# EAGLE design NanoModem (EAGLE 6.5.0)
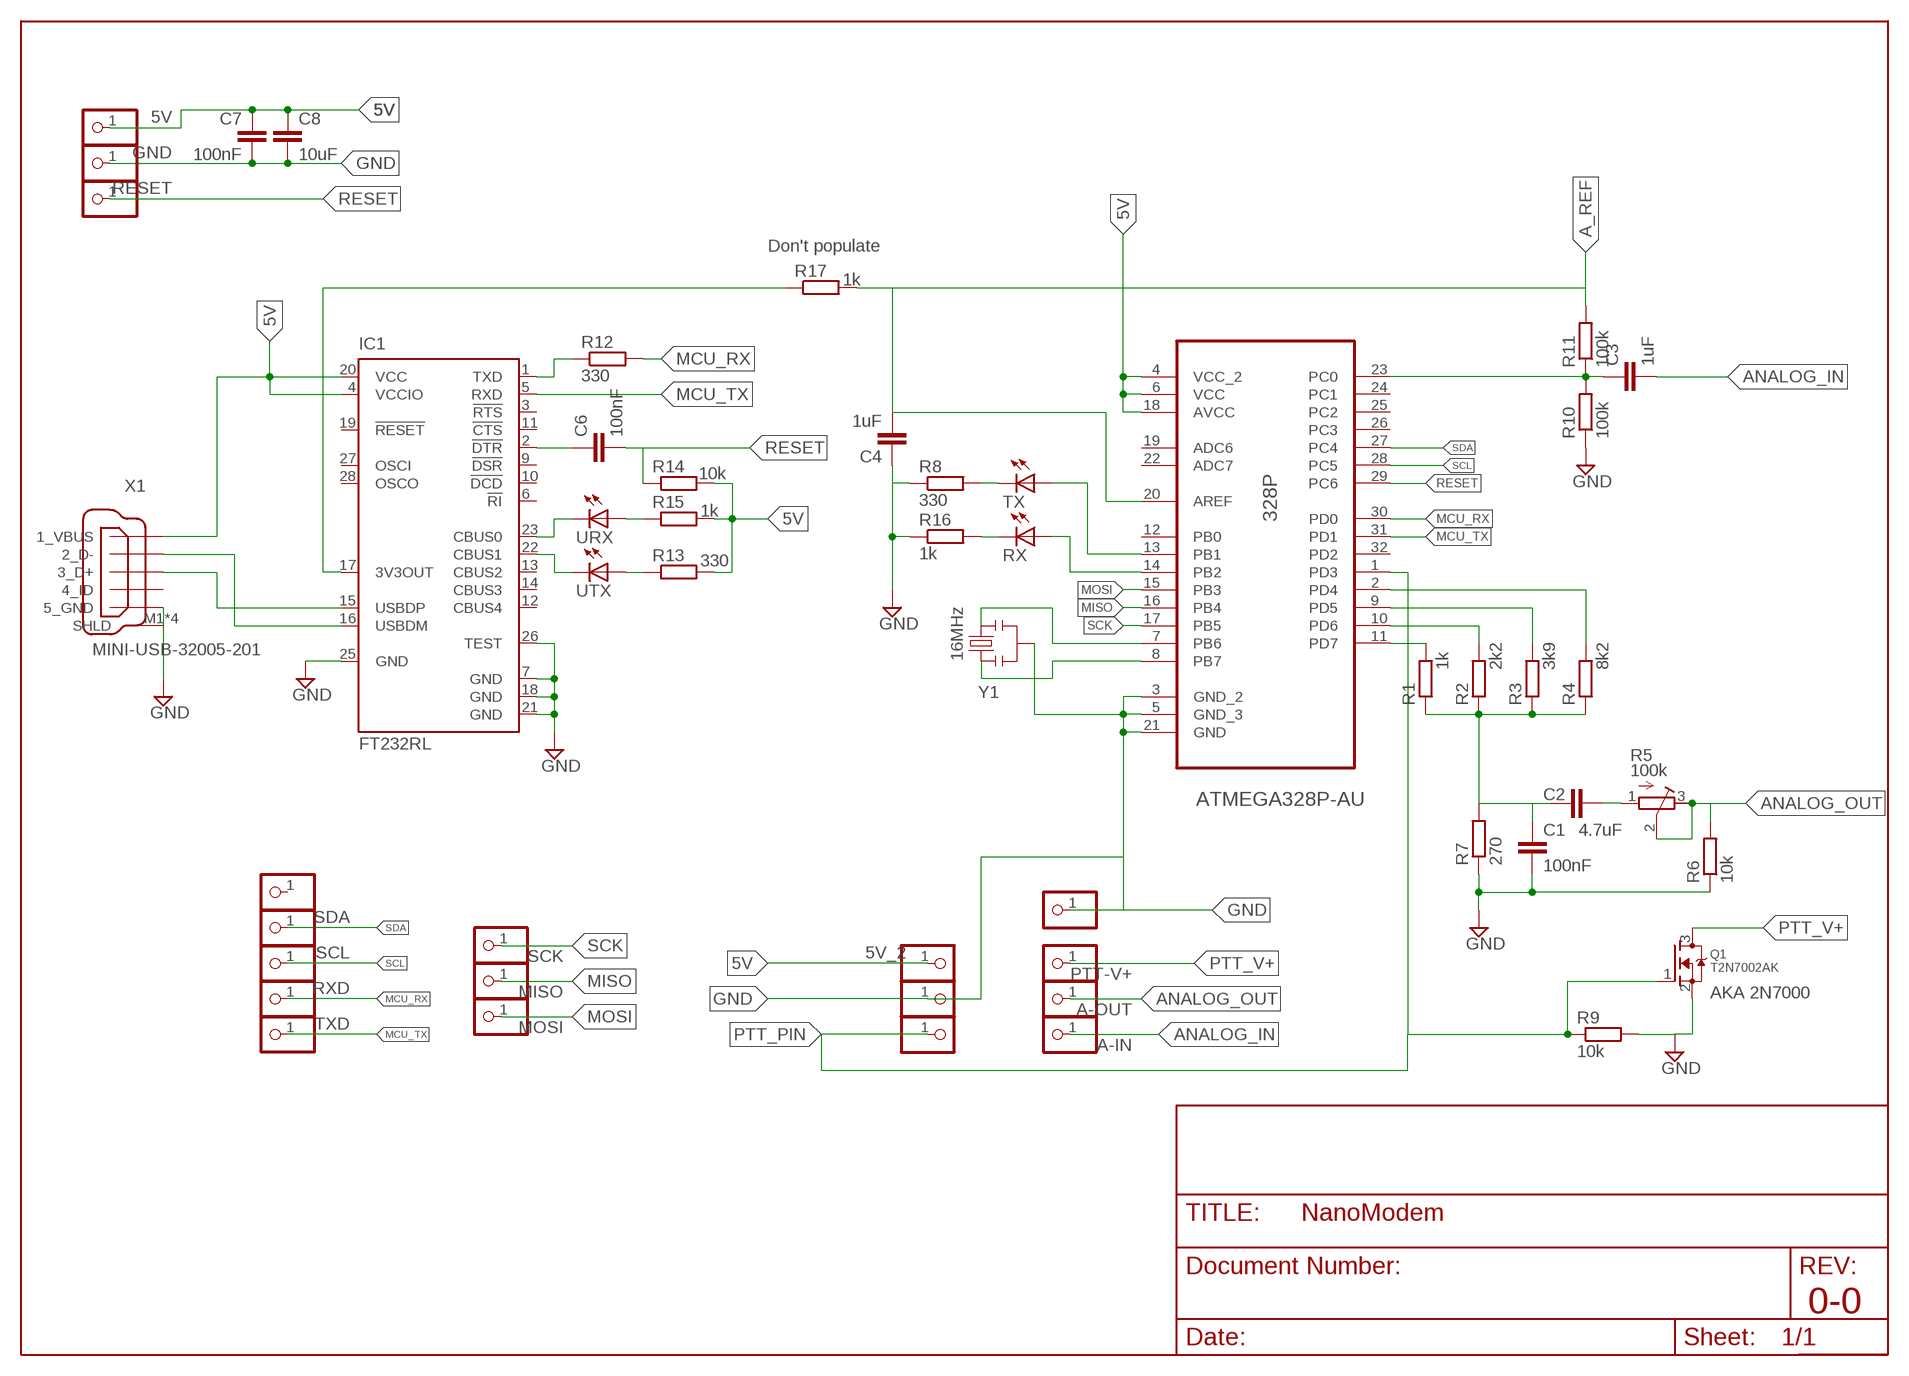
[diagram p0: schematic, sheet 1]

## Parts
3V3  PINHD-1X1  [1X01]
5V  PINHD-1X1  [1X01]
5V_2  PINHD-1X1  [1X01]
328P  ATMEGA328P-AU  [QFP80P900X900X120-32N]
A-IN  PINHD-1X1  [1X01]
A-OUT  PINHD-1X1  [1X01]
C1  100nF  C-EUC0603  [C0603]
C2  4.7uF  C-EUC0805  [C0805]
C3  1uF  C-EUC0603  [C0603]
C4  1uF  C-EUC0603  [C0603]
C6  100nF  C-EUC0603  [C0603]
C7  100nF  C-EUC0603  [C0603]
C8  10uF  C-EUC1210  [C1210]
GND  PINHD-1X1  [1X01]
GND1  PINHD-1X1  [1X01]
GND2  PINHD-1X1  [1X01]
IC1  FT232RL  [SSOP28]
MISO  PINHD-1X1  [1X01]
MOSI  PINHD-1X1  [1X01]
PTT-PIN  PINHD-1X1  [1X01]
PTT-V+  PINHD-1X1  [1X01]
Q1  T2N7002AK  MOSFET-NREFLOW  [SOT23]
R1  1k  R-EU_R0603  [R0603]
R2  2k2  R-EU_R0603  [R0603]
R3  3k9  R-EU_R0603  [R0603]
R4  8k2  R-EU_R0603  [R0603]
R5  100k  R-TRIMM3339P  [RTRIM3339P]
R6  10k  R-EU_R0603  [R0603]
R7  270  R-EU_R0603  [R0603]
R8  330  R-EU_R0603  [R0603]
R9  10k  R-EU_R0603  [R0603]
R10  100k  R-EU_R0603  [R0603]
R11  100k  R-EU_R0603  [R0603]
R12  330  R-EU_R0603  [R0603]
R13  330  R-EU_R0603  [R0603]
R14  10k  R-EU_R0603  [R0603]
R15  1k  R-EU_R0603  [R0603]
R16  1k  R-EU_R0603  [R0603]
R17  1k  R-EU_R0603  [R0603]
RESET  PINHD-1X1  [1X01]
RX  LED_ESML0603  [LED_SML0603]
RXD  PINHD-1X1  [1X01]
SCK  PINHD-1X1  [1X01]
SCL  PINHD-1X1  [1X01]
SDA  PINHD-1X1  [1X01]
TX  LED_ESML0603  [LED_SML0603]
TXD  PINHD-1X1  [1X01]
URX  LED_ESML0603  [LED_SML0603]
UTX  LED_ESML0603  [LED_SML0603]
X1  MINI-USB-32005-201  [32005-201]
Y1  16MHz  RESONATOR16MHZ  [RESONATOR-SMD]

## Nets
3V3: IC1.17(3V3OUT) R17.1
5V: 5V.1 5V_2.1 328P.4(VCC_2) 328P.6(VCC) 328P.18(AVCC) C7.2 C8.1 IC1.4(VCCIO) IC1.20(VCC) R13.2 R14.2 R15.2 X1.1_VBUS
A_REF: 328P.20(AREF) C4.2 R11.2 R17.2
ADC0: 328P.23(PC0) C3.1 R10.2 R11.1
ANALOG_IN: A-IN.1 C3.2
ANALOG_OUT: A-OUT.1 R5.2(S) R5.3(E) R6.2
DAC_1: 328P.2(PD4) R4.2
DAC_2: 328P.9(PD5) R3.2
DAC_3: 328P.10(PD6) R2.2
DAC_4: 328P.11(PD7) R1.2
DTR: C6.1 IC1.2(!DTR)
FTDI_TX: IC1.1(TXD) R12.1
GND: 328P.3(GND_2) 328P.5(GND_3) 328P.21(GND) C1.2 C4.1 C7.1 C8.2 GND1.1 GND2.1 GND.1 IC1.7(GND) IC1.18(GND) IC1.21(GND) IC1.25(GND) IC1.26(TEST) Q1.2(S) R6.1 R7.1 R8.1 R9.2 R10.1 R16.1 X1.5_USB_GND(5_GND) X1.M1(SHLD) X1.M2(SHLD) X1.M3(SHLD) X1.M4(SHLD) Y1.2
MCU_RX: 328P.30(PD0) R12.2 RXD.1
MCU_TX: 328P.31(PD1) IC1.5(RXD) TXD.1
MISO: 328P.16(PB4) MISO.1
MOSI: 328P.15(PB3) MOSI.1
N$1: R13.1 UTX.A
N$2: IC1.23(CBUS0) URX.C
N$3: IC1.22(CBUS1) UTX.C
N$4: R15.1 URX.A
N$5: 328P.7(PB6) Y1.3
N$6: C1.1 C2.2 R1.1 R2.1 R3.1 R4.1 R7.2
N$7: R16.2 RX.C
N$8: 328P.14(PB2) RX.A
N$10: 328P.13(PB1) TX.A
N$11: C2.1 R5.1(A)
N$12: 328P.8(PB7) Y1.1
N$13: R8.2 TX.C
N$14: IC1.15(USBDP) X1.3_D+
N$15: IC1.16(USBDM) X1.2_D-
PTT_PIN: 328P.1(PD3) PTT-PIN.1 Q1.1(G) R9.1
PTT_V+: PTT-V+.1 Q1.3(D)
RESET: 328P.29(PC6) C6.2 R14.1 RESET.1
SCK: 328P.17(PB5) SCK.1
SCL: 328P.28(PC5) SCL.1
SDA: 328P.27(PC4) SDA.1
Unconnected: 3V3.1 328P.12(PB0) 328P.19(ADC6) 328P.22(ADC7) 328P.24(PC1) 328P.25(PC2) 328P.26(PC3) 328P.32(PD2) IC1.3(!RTS) IC1.6(!RI) IC1.9(!DSR) IC1.10(!DCD) IC1.11(!CTS) IC1.12(CBUS4) IC1.13(CBUS2) IC1.14(CBUS3) IC1.19(!RESET) IC1.27(OSCI) IC1.28(OSCO) X1.4_ID

## Notes on the sheet
- Don't populate
- AKA 2N7000
- 0-0

## Library data of the parts
3V3 5V 5V_2 A-IN A-OUT GND GND1 GND2 MISO MOSI PTT-PIN PTT-V+ RESET RXD SCK SCL SDA TXD = adafruit:PINHD-1X1: Pin header 1x1 for 0.1" spacing With round pins
328P = Atmel_By_element14_Batch_1-00:ATMEGA328P-AU: 8-bit Microcontroller with In-System Programmable Flash; MPN: ATMEGA328P-AU; OC_FARNELL: 1715486; OC_NEWARK: 14R4631; PACKAGE: TQFP-32; SUPPLIER: Atmel
C1-C4 C6-C8 = rcl:C-EU: CAPACITOR, European symbol
IC1 = ftdichip:FT232R: Source: http://www.ftdichip.com/Documents/DataSheets/DS_FT232R_v104.pdf; MPN: FT232RL; OC_FARNELL: 1146032; OC_NEWARK: 91K9918
Q1 = adafruit-edited:MOSFET-N: N-Channel Mosfet 2N7002E - 60V 260mA SOT23 [Digikey: 2N7002ET1GOSTR-ND] - REEL BSH103 - 30V 850mA SOT23 [Digikey: 568-5013-1-ND]
R1-R4 R6-R17 = rcl:R-EU_: RESISTOR, European symbol
R5 = rcl:R-TRIMM: Trimm resistor
RX TX URX UTX = eagle-ltspice:LED_E: LED Source: http://www.osram.convergy.de Source: www.luxeon.com Source: www.kingbright.com; SPICEMODEL: NONE; SPICEPREFIX: D; SPICETYPE: diode
X1 = wifi_WX:MINI-USB-: MINI USB-B Conector Source: www.cypressindustries.com
Y1 = SparkFun-FreqCtrl:RESONATOR: Resonator Small SMD resonator. Used, eg, on the Arduino Pro/ Pro Mini boards. 8MHz- XTAL-08895 16MHz- XTAL-08900; PROD_ID: XTAL-08900

## Board
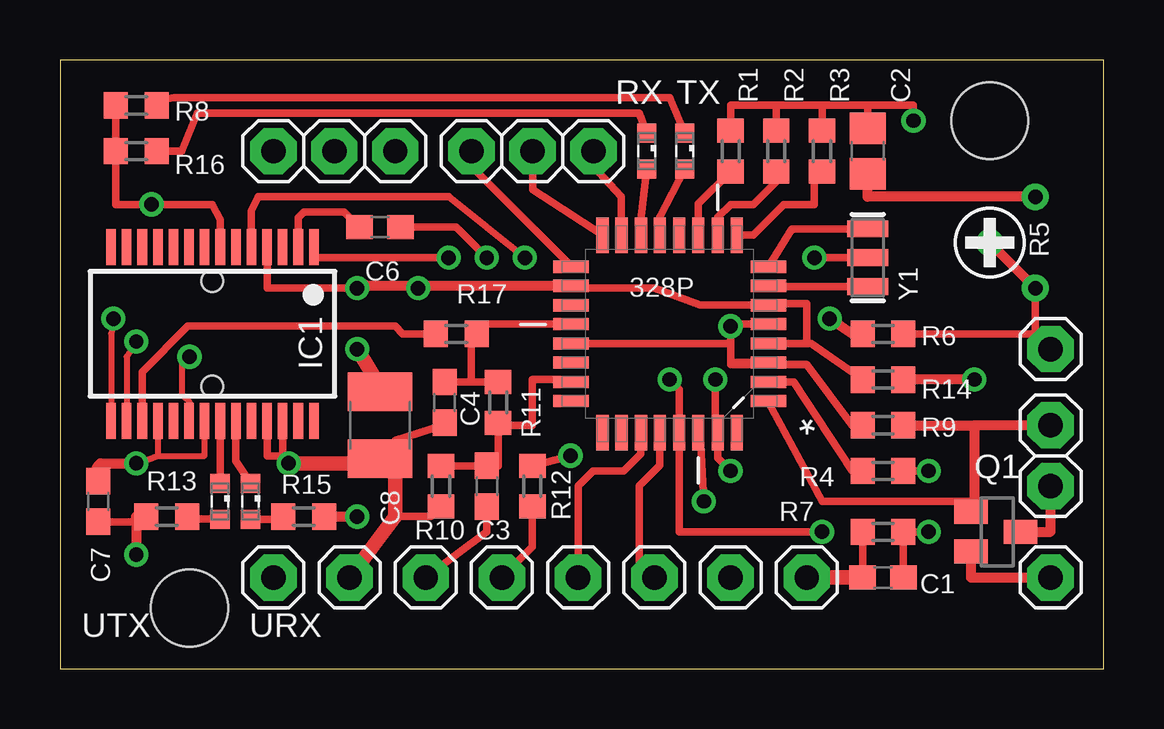
[diagram p1: board, top side]
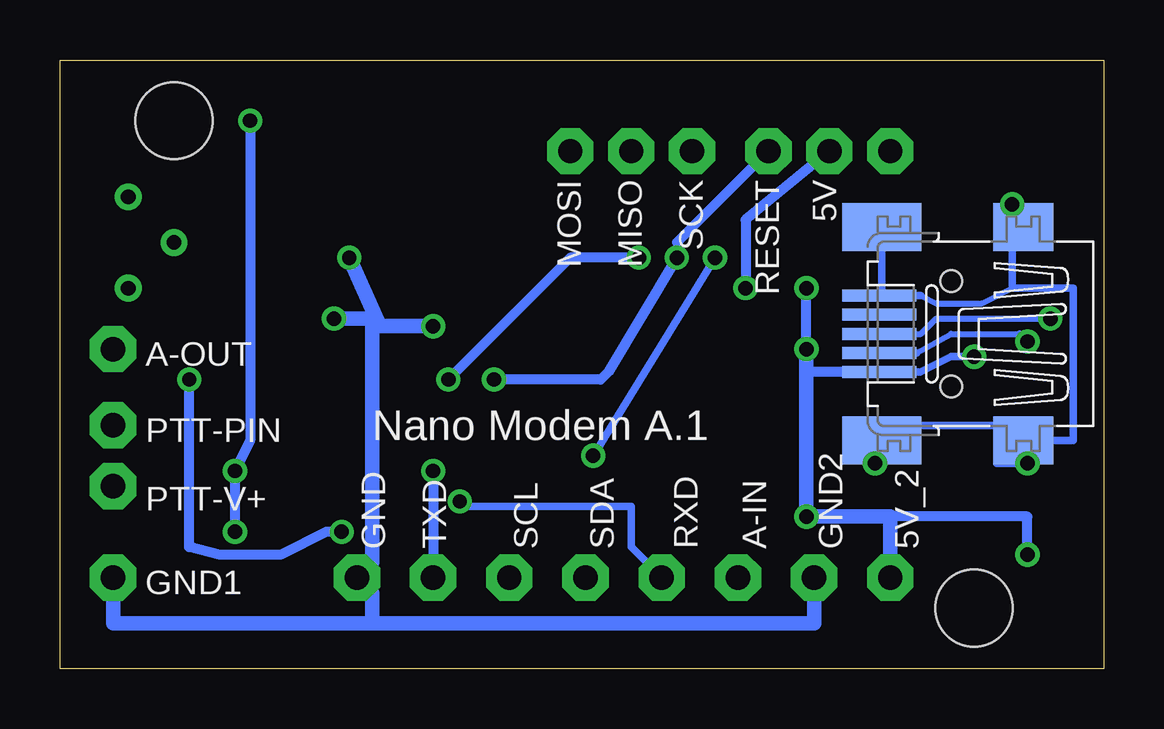
[diagram p2: board, bottom side, seen from below]

Size 43.48 x 25.39 mm. Coordinates in mm from the lower left corner, seen from the top.
Outline: 0,0 43.48,0 43.48,25.39 0,25.39 0,0
Copper layers (1*16): Top 0.035mm / dielectric 1.5mm / Bottom 0.035mm
Design rules "default": minimum track width 10mil, minimum drill 0.6mm, track to track 8mil, track to pad 8mil, pad to pad 8mil, via to via 8mil, smd to smd 8mil, copper to edge 40mil, drill to drill 8mil, minimum pad ring 10mil, minimum via ring 8mil, stop-mask expansion 4mil, vias tented up to drill 0mil, thermal gap 10mil
Holes 3.2 mm at 5.4,2.54 38.73,22.86

### Footprints (pad centres in the part's own frame; a part is rotated, then mirrored left to right if it is on the bottom)
1X01 = drill 1.016 pad 1.93 octagon: 1 0,0
QFP80P900X900X120-32N = smd 1.473 x 0.508: 1 -4.115,2.794; 2 -4.115,2.007; 3 -4.115,1.194; 4 -4.115,0.406; 5 -4.115,-0.406; 6 -4.115,-1.194; 7 -4.115,-2.007; 8 -4.115,-2.794; 17 4.115,-2.794; 18 4.115,-2.007; 19 4.115,-1.194; 20 4.115,-0.406; 21 4.115,0.406; 22 4.115,1.194; 23 4.115,2.007; 24 4.115,2.794 | smd 0.508 x 1.473: 9 -2.794,-4.115; 10 -2.007,-4.115; 11 -1.194,-4.115; 12 -0.406,-4.115; 13 0.406,-4.115; 14 1.194,-4.115; 15 2.007,-4.115; 16 2.794,-4.115; 25 2.794,4.115; 26 2.007,4.115; 27 1.194,4.115; 28 0.406,4.115; 29 -0.406,4.115; 30 -1.194,4.115; 31 -2.007,4.115; 32 -2.794,4.115
C0603 = smd 1.1 x 1: 1 -0.85,0; 2 0.85,0
C0805 = smd 1.3 x 1.5: 1 -0.95,0; 2 0.95,0
C1210 = smd 1.6 x 2.7: 1 -1.4,0; 2 1.4,0
SSOP28 = smd 0.4 x 1.5: 1 -4.225,-3.625; 2 -3.575,-3.625; 3 -2.925,-3.625; 4 -2.275,-3.625; 5 -1.625,-3.625; 6 -0.975,-3.625; 7 -0.325,-3.625; 8 0.325,-3.625; 9 0.975,-3.625; 10 1.625,-3.625; 11 2.275,-3.625; 12 2.925,-3.625; 13 3.575,-3.625; 14 4.225,-3.625; 15 4.225,3.625; 16 3.575,3.625; 17 2.925,3.625; 18 2.275,3.625; 19 1.625,3.625; 20 0.975,3.625; 21 0.325,3.625; 22 -0.325,3.625; 23 -0.975,3.625; 24 -1.625,3.625; 25 -2.275,3.625; 26 -2.925,3.625; 27 -3.575,3.625; 28 -4.225,3.625
SOT23 = smd 1 x 1.4: 1 -0.823,-1.1; 2 0.823,-1.1; 3 0,0.973
R0603 = smd 1 x 1.1: 1 -0.85,0; 2 0.85,0
RTRIM3339P = drill 0.61: 1 -1.905,1.905; 2 0,0; 3 1.905,1.905
LED_SML0603 = smd 0.8 x 0.8: A 0.75,0; C -0.75,0
32005-201 = smd 3.1 x 0.5: 1_VBUS 3,1.6; 2_D- 3,0.8; 3_D+ 3,0; 4_ID 3,-0.8; 5_USB_GND 3,-1.6 | smd 2.5 x 2: M1 -3,-4.45; M2 -3,4.45 | smd 3.3 x 2: M3 2.9,4.45; M4 2.9,-4.45 | hole 0.9: 0,2.2; 0,-2.2
RESONATOR-SMD = smd 0.7 x 1.7: 1 -1.2,0; 2 0,0; 3 1.2,0

### Placement (x,y rotation side)
3V3  8.89,21.59 0 top
5V  11.43,21.59 0 top
5V_2  8.89,3.81 0 top
328P  25.4,13.97 180 top
A-IN  15.24,3.81 0 top
A-OUT  41.27,13.33 0 top
C1  34.29,3.81 180 top
C2  33.66,21.59 90 top
C3  17.78,7.62 270 top
C4  16.03,11.11 90 top
C6  13.34,18.42 0 top
C7  1.59,6.98 270 top
C8  13.34,10.16 270 top
GND  31.11,3.81 0 top
GND1  41.27,3.81 0 top
GND2  12.06,3.81 0 top
IC1  6.35,13.97 180 top
MISO  19.68,21.59 0 top
MOSI  22.23,21.59 0 top
PTT-PIN  41.27,10.16 0 top
PTT-V+  41.27,7.62 0 top
Q1  39.05,5.71 270 top
R1  27.94,21.59 270 top
R2  29.84,21.59 270 top
R3  31.75,21.59 270 top
R4  34.29,8.26 180 top
R5  38.73,17.78 270 top
R6  34.29,13.97 0 top
R7  34.29,5.71 0 top
R8  3.17,23.5 0 top
R9  34.29,10.16 180 top
R10  15.88,7.62 90 top
R11  18.26,11.11 90 top
R12  19.68,7.62 270 top
R13  4.45,6.35 180 top
R14  34.29,12.06 180 top
R15  10.16,6.35 0 top
R16  3.17,21.59 0 top
R17  16.51,13.97 0 top
RESET  13.97,21.59 90 top
RX  24.45,21.59 270 top
RXD  18.41,3.81 0 top
SCK  17.14,21.59 0 top
SCL  24.77,3.81 0 top
SDA  21.59,3.81 0 top
TX  26.04,21.59 270 top
TXD  27.94,3.81 0 top
URX  7.94,6.98 270 top
UTX  6.67,6.98 270 top
X1  6.35,13.97 180 bottom
Y1  33.66,17.15 270 top

### Tracks (layer width: path | path; a pad name or v marks a point on that pad's centre or on a via)
3V3
  Top 0.305: R17.1 14.29,13.97 13.97,14.29 5.33,14.29 3.42,12.38 IC1.17
5V  (via drill 0.6)
  Top 0.254: v5.4,13.02 5.08,12.7 5.08,11.43 5.4,11.11 5.4,10.37
  Top 0.305: 328P.4 31.11,13.56 | 31.11,13.56 31.11,15.24 29.52,15.24 328P.6 26.67,15.16 24.77,15.88 21.29,15.88 328P.18 | 5.4,10.37 IC1.20 | v12.38,15.88 8.62,15.88 IC1.4 | 31.11,13.56 31.31,13.56 R14.2 | v14.92,15.88 14.92,15.98 | C7.2 3.38,6.13 R13.2
  Top 0.406: R15.2 v12.38,6.35 | 3.38,6.13 arc90 R13.2 3.17,6.35 v3.17,4.76 | v12.38,15.88 arc-90 12.8,15.98 14.92,15.98 328P.18
  Top 0.61: C8.1 13.34,11.75 v12.38,13.33
  Bottom 0.305: X1.1_VBUS 7.63,12.37 6.35,13.02 v5.4,13.02
  Bottom 0.406: X1.1_VBUS 12.38,12.37 v12.38,13.33 v12.38,15.88 | v3.17,4.76 3.17,6.35 8.89,6.35 | 5V.1 14.92,18.73 v14.92,15.88
  Bottom 0.61: v12.38,13.33 v12.38,6.35 8.89,6.35 5V_2.1
A_REF
  Top 0.305: 328P.20 17.36,14.38 R17.2 17.14,13.97 17.14,11.96 | C4.2 17.14,11.96 | 17.14,11.96 R11.2
ADC0
  Top 0.305: R10.2 C3.1 18.26,8.47 R11.1 18.26,10.16 19.68,10.16 19.68,12.06 21.18,12.06 328P.23
ANALOG_IN
  Top 0.305: 17.78,6.98 C3.2 17.78,5.71 A-IN.1
ANALOG_OUT
  Top 0.305: R6.2 40.64,13.97 | 40.64,13.97 R5.3 | A-OUT.1 40.64,13.97
  Top 0.406: R5.2 R5.3
DAC_1
  Top 0.305: 328P.2 30.58,11.96 33.02,8.26 R4.2
DAC_2
  Top 0.305: 328P.9 28.88,18.09 30.16,19.37 31.43,19.37 31.43,20.42 R3.2
DAC_3
  Top 0.305: 328P.10 27.41,18.83 27.94,19.37 28.89,19.37 29.84,20.32 R2.2
DAC_4
  Top 0.305: 328P.11 26.59,19.39 R1.2
DTR
  Top 0.305: IC1.2 9.93,18.82 10.16,19.05 11.85,19.05 C6.1
FTDI_TX  (via drill 0.6)
  Top 0.305: R12.1 v21.27,8.89 | 10.61,17.6 IC1.1 10.57,17.15 v16.19,17.15
  Bottom 0.305: v16.19,17.15 v21.27,8.89
GND  (via drill 0.6)
  Top 0.254: IC1.18 4.08,8.89 | 4.08,8.89 6.03,8.89 IC1.21 | v3.17,8.57 4.08,8.89
  Top 0.305: 328P.21 27.94,13.56 | 27.94,12.78 27.94,12.7 29.52,12.7 328P.3 | 328P.3 27.94,12.78 | 27.94,12.78 27.94,13.56 | IC1.26 9.28,8.89 | 9.28,8.89 8.62,8.89 IC1.25 | 9.28,8.89 v9.53,8.57 | Y1.2 v31.43,17.15 | 27.94,13.56 v27.94,14.29 27.94,14.38 328P.5 | 328P.3 29.59,12.7 31.11,12.7 33.02,10.16 R9.2 | C1.2 R7.1 | IC1.7 6.67,18.73 6.35,19.37 v3.81,19.37 2.33,19.37 R16.1 R8.1 | R10.1 15.46,6.35 13.97,6.35 | 13.97,8.26 13.97,9.53 15.93,10.16 arc90 C4.1
  Top 0.406: C7.1 arc-90 1.69,8.57 v3.17,8.57 | 12.7,8.57 C8.2 | R6.1 33.02,13.97 v32.07,14.61 | Q1.2 37.95,3.81 GND1.1
  Top 0.61: 12.7,8.57 v9.53,8.57 | C1.2 GND.1 | GND2.1 13.97,6.35 13.97,8.26 C8.2
  Bottom 0.254: X1.M2 3.17,9.52 v3.17,8.57 | 7.62,15.57 6.99,15.24 5.08,15.24 3.81,15.88
  Bottom 0.305: 7.62,15.57 X1.5_USB_GND 9.25,15.57 X1.M4 8.26,18.42 8.26,19.05 | X1.M2 1.27,9.53 1.27,15.88 3.81,15.88 3.81,18.42 X1.M1 3.81,18.88 v3.81,19.37 | X1.M3 9.25,8.89 v9.53,8.57 9.53,10.16 4.45,10.16 4.45,8.57 v3.17,8.57
  Bottom 0.406: 30.48,14.61 30.48,14.29
  Bottom 0.61: v27.94,14.29 30.16,14.29 | 30.16,14.29 30.48,14.29 30.48,4.45 GND.1 30.48,3.17 30.48,1.91 | 30.16,14.29 v31.43,17.15 | 30.48,1.91 12.06,1.91 GND2.1 | v32.07,14.61 30.48,14.61 | 30.48,1.91 41.27,1.91 GND1.1
MCU_RX  (via drill 0.6)
  Top 0.305: RXD.1 19.68,5.08 R12.2 | 328P.30 26.67,9.78 v26.83,6.98
  Bottom 0.305: v26.83,6.98 26.45,6.77 R12.2 19.68,5.08 RXD.1
MCU_TX  (via drill 0.6)
  Top 0.305: v27.94,8.26 27.41,8.79 328P.31 27.3,9.96 v27.3,12.06 | v19.37,17.15 16.19,19.69 8.26,19.69 7.97,19.09 IC1.5
  Bottom 0.406: v27.94,8.26 TXD.1 | v19.37,17.15 22.23,17.15 v27.3,12.06
MISO
  Top 0.305: MISO.1 19.7,19.99 328P.16
MOSI
  Top 0.305: 328P.15 23.39,19.69 22.23,20.96 MOSI.1
N$1
  Top 0.305: R13.1 5.61,6.25 6.35,6.25 UTX.A
N$2
  Top 0.305: IC1.23 7.33,8.66 URX.C
N$3
  Top 0.305: IC1.22 6.67,8.7 UTX.C
N$4
  Top 0.305: URX.A 8.99,6.23 R15.1
N$5
  Top 0.305: 328P.7 arc90 29.55,15.95 Y1.3
N$6  (via drill 0.6)
  Top 0.305: C1.1 R7.2 v36.2,5.71 | R4.1 v36.2,8.26 | R1.1 27.94,23.5 29.84,23.5 | R2.1 29.84,23.5 | 29.84,23.5 31.75,23.5 | v35.56,22.86 35.56,23.5 33.66,23.5 | 31.75,23.5 33.66,23.5 | C2.2 33.66,23.5 | 31.75,23.5 R3.1
  Bottom 0.406: v36.2,5.71 v36.2,8.26 35.56,9.53 v35.56,22.86
N$7
  Top 0.305: RX.C 24.13,23.18 5.71,23.18 5.08,21.59 R16.2
N$8
  Top 0.305: 328P.14 24.13,18.16 RX.A
N$10
  Top 0.305: 328P.13 24.99,18.85 TX.A
N$11
  Top 0.406: R5.1 33.66,19.69 C2.1
N$12
  Top 0.305: Y1.1 30.48,18.35 328P.8
N$13
  Top 0.305: R8.2 4.03,23.71 4.76,23.81 25.4,23.81 TX.C
N$14  (via drill 0.6)
  Top 0.254: v2.22,14.61 2.12,13.97 IC1.15
  Bottom 0.254: v2.22,14.61 6.99,14.61 7.62,13.97 8.26,13.97
  Bottom 0.305: X1.3_D+ 8.26,13.97
N$15  (via drill 0.6)
  Top 0.254: v3.17,13.65 2.77,13.02 IC1.16
  Bottom 0.254: 7.79,13.17 6.35,13.97 3.49,13.97
  Bottom 0.305: X1.2_D- 7.79,13.17 | 3.49,13.97 v3.17,13.65
PTT_PIN
  Top 0.305: 328P.1 29.52,11.12 31.75,6.98 38.1,6.98
  Top 0.406: Q1.1 38.1,7 | R9.1 38.1,10.16 | 38.1,10.16 38.1,7 | 38.1,7 38.1,6.98 | PTT-PIN.1 38.1,10.16
PTT_V+
  Top 0.406: Q1.3 41.27,5.71 PTT-V+.1
RESET  (via drill 0.6)
  Top 0.305: v31.75,5.71 25.81,5.71 328P.29 25.81,11.66 v25.4,12.06 | C6.2 16.51,18.42 v17.78,17.15
  Top 0.406: v38.1,12.06 R14.1
  Bottom 0.305: 17.78,17.78 v17.78,17.15
  Bottom 0.406: v17.78,17.15 20.64,12.38 20.95,12.06 v25.4,12.06 | v31.75,5.71 32.38,5.71 34.29,4.76 36.83,4.76 38.1,5.08 v38.1,12.06 | RESET.1 17.78,17.78
SCK
  Top 0.305: 328P.17 21.29,16.82 17.14,20.96 SCK.1
SCL
  Top 0.305: 328P.28 24.99,8.48 24.13,7.62 24.13,4.45 SCL.1
SDA
  Top 0.305: 328P.27 24.21,8.97 23.5,8.26 22.23,8.26 21.59,7.62 SDA.1

### Text on the board
bNames: Nano Modem A.1